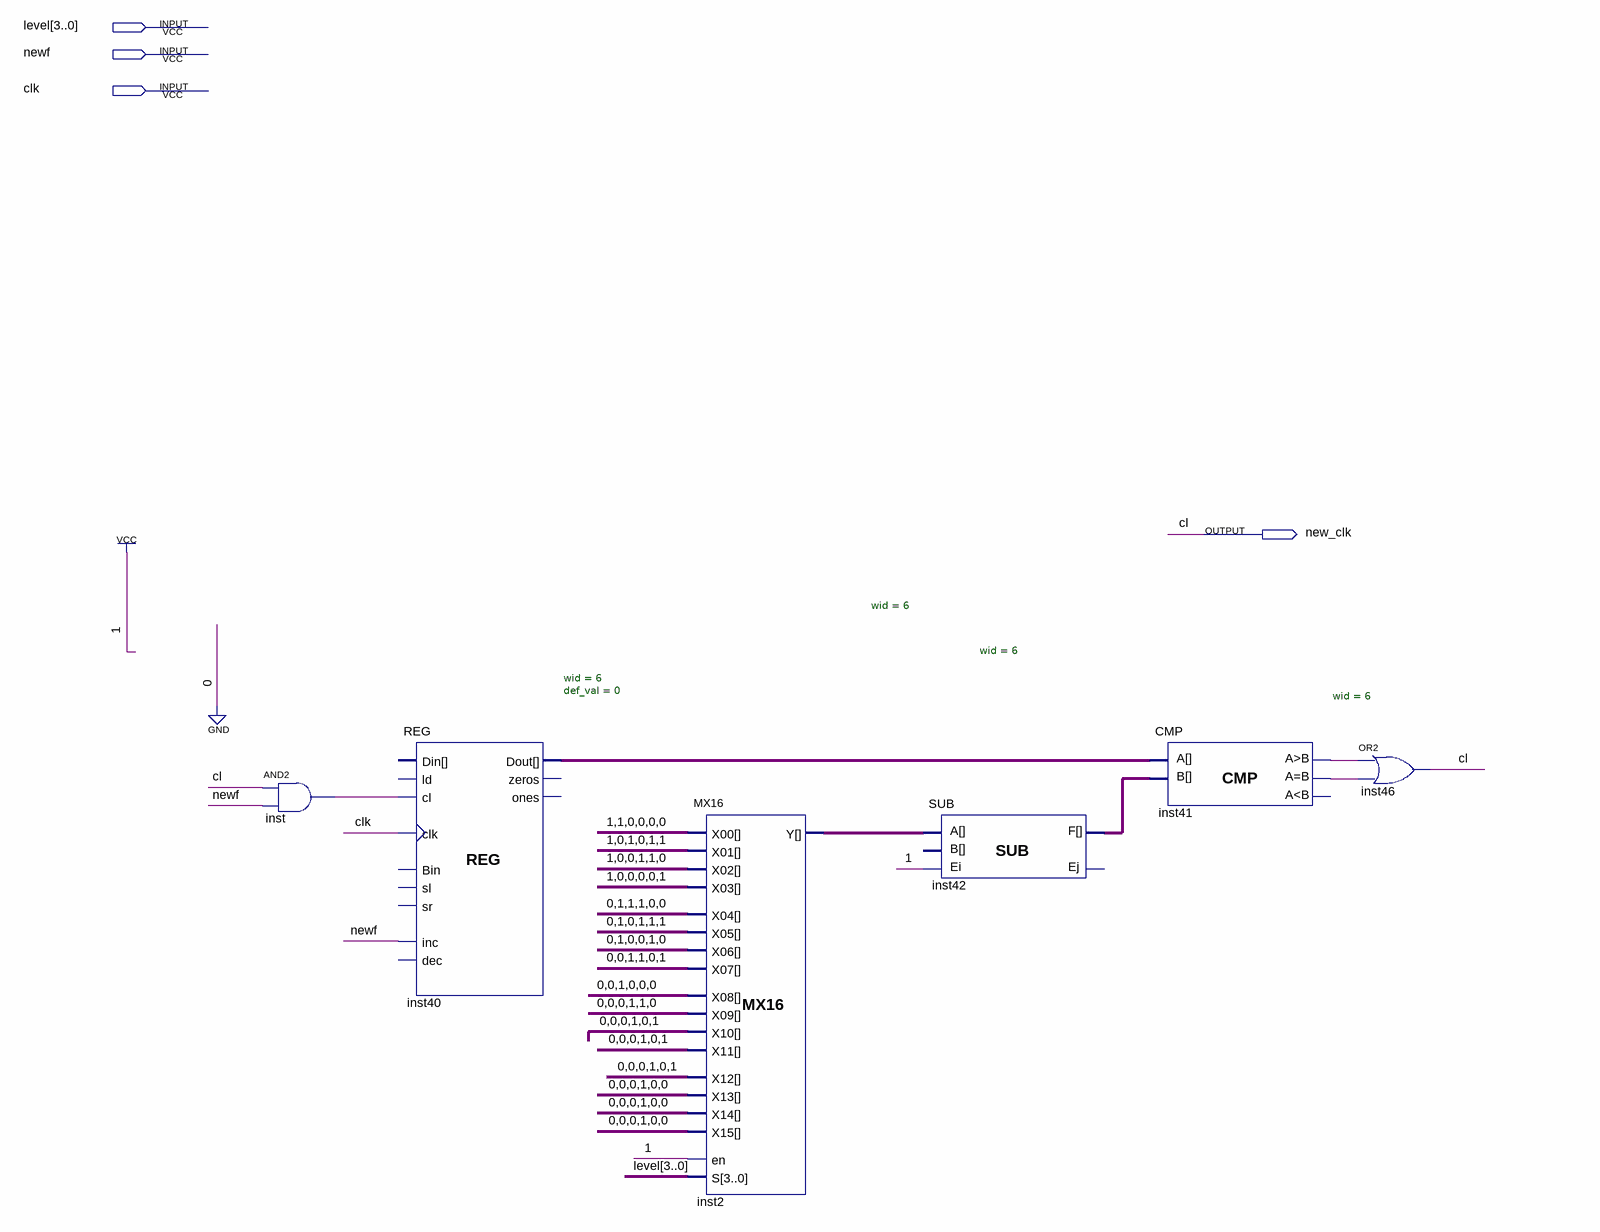
[diagram p0: schematic sheet]
// Quartus schematic gearbox.bdf as structural Verilog: 6 symbols, 4 pins
module gearbox (
  input  [3:0] level,
  input  newf,
  input  clk,
  output new_clk
);

  wire inst41_eq, inst41_gr, inst_out;
  wire [5:0] inst2_y, inst40_dout, inst42_f;

  and inst (inst_out, new_clk, newf);
  REG #(.wid(6), .def_val(0)) inst40 (
    .cl(inst_out), .clk(clk), .inc(newf), .Dout(inst40_dout));  // open: ld, Bin, sl, sr, dec, Din, zeros, ones
  MX16 #(.wid(6)) inst2 (
    .X00(6'b110000), .X01(6'b101011), .X02(6'b100110), .X03(6'b100001), .X04(6'b011100), .X05(6'b010111),
    .X06(6'b010010), .X07(6'b001101), .X08(6'b001000), .X09(6'b000110), .X10(6'b000101), .X11(6'b000101),
    .X12(6'b000101), .X13(6'b000100), .X14(6'b000100), .X15(6'b000100), .en(1'b1), .S(level), .Y(inst2_y));
  SUB #(.wid(6)) inst42 (.A(inst2_y), .Ei(1'b1), .F(inst42_f));  // open: B, Ej
  CMP #(.wid(6)) inst41 (.A(inst40_dout), .B(inst42_f), .gr(inst41_gr), .eq(inst41_eq));  // open: ls
  or inst46 (new_clk, inst41_gr, inst41_eq);

  // Other names for the same wires on the sheet: cl = new_clk
endmodule
